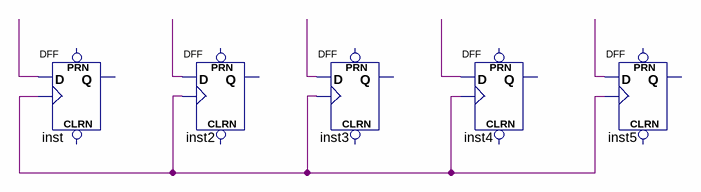
[diagram p0: schematic sheet]
// Quartus schematic Esquema.bdf as structural Verilog: 5 symbols, 0 pins
module Esquema (
);

  wire undriven, undriven_2, undriven_3, undriven_4, undriven_5, undriven_6;

  DFF inst (.CLK(undriven_6), .D(undriven));  // open: CLRN, PRN, Q
  DFF inst2 (.CLK(undriven_6), .D(undriven_2));  // open: CLRN, PRN, Q
  DFF inst3 (.CLK(undriven_6), .D(undriven_3));  // open: CLRN, PRN, Q
  DFF inst4 (.CLK(undriven_6), .D(undriven_4));  // open: CLRN, PRN, Q
  DFF inst5 (.CLK(undriven_6), .D(undriven_5));  // open: CLRN, PRN, Q
endmodule
